# EAGLE design tweezer (EAGLE 9.4.2)
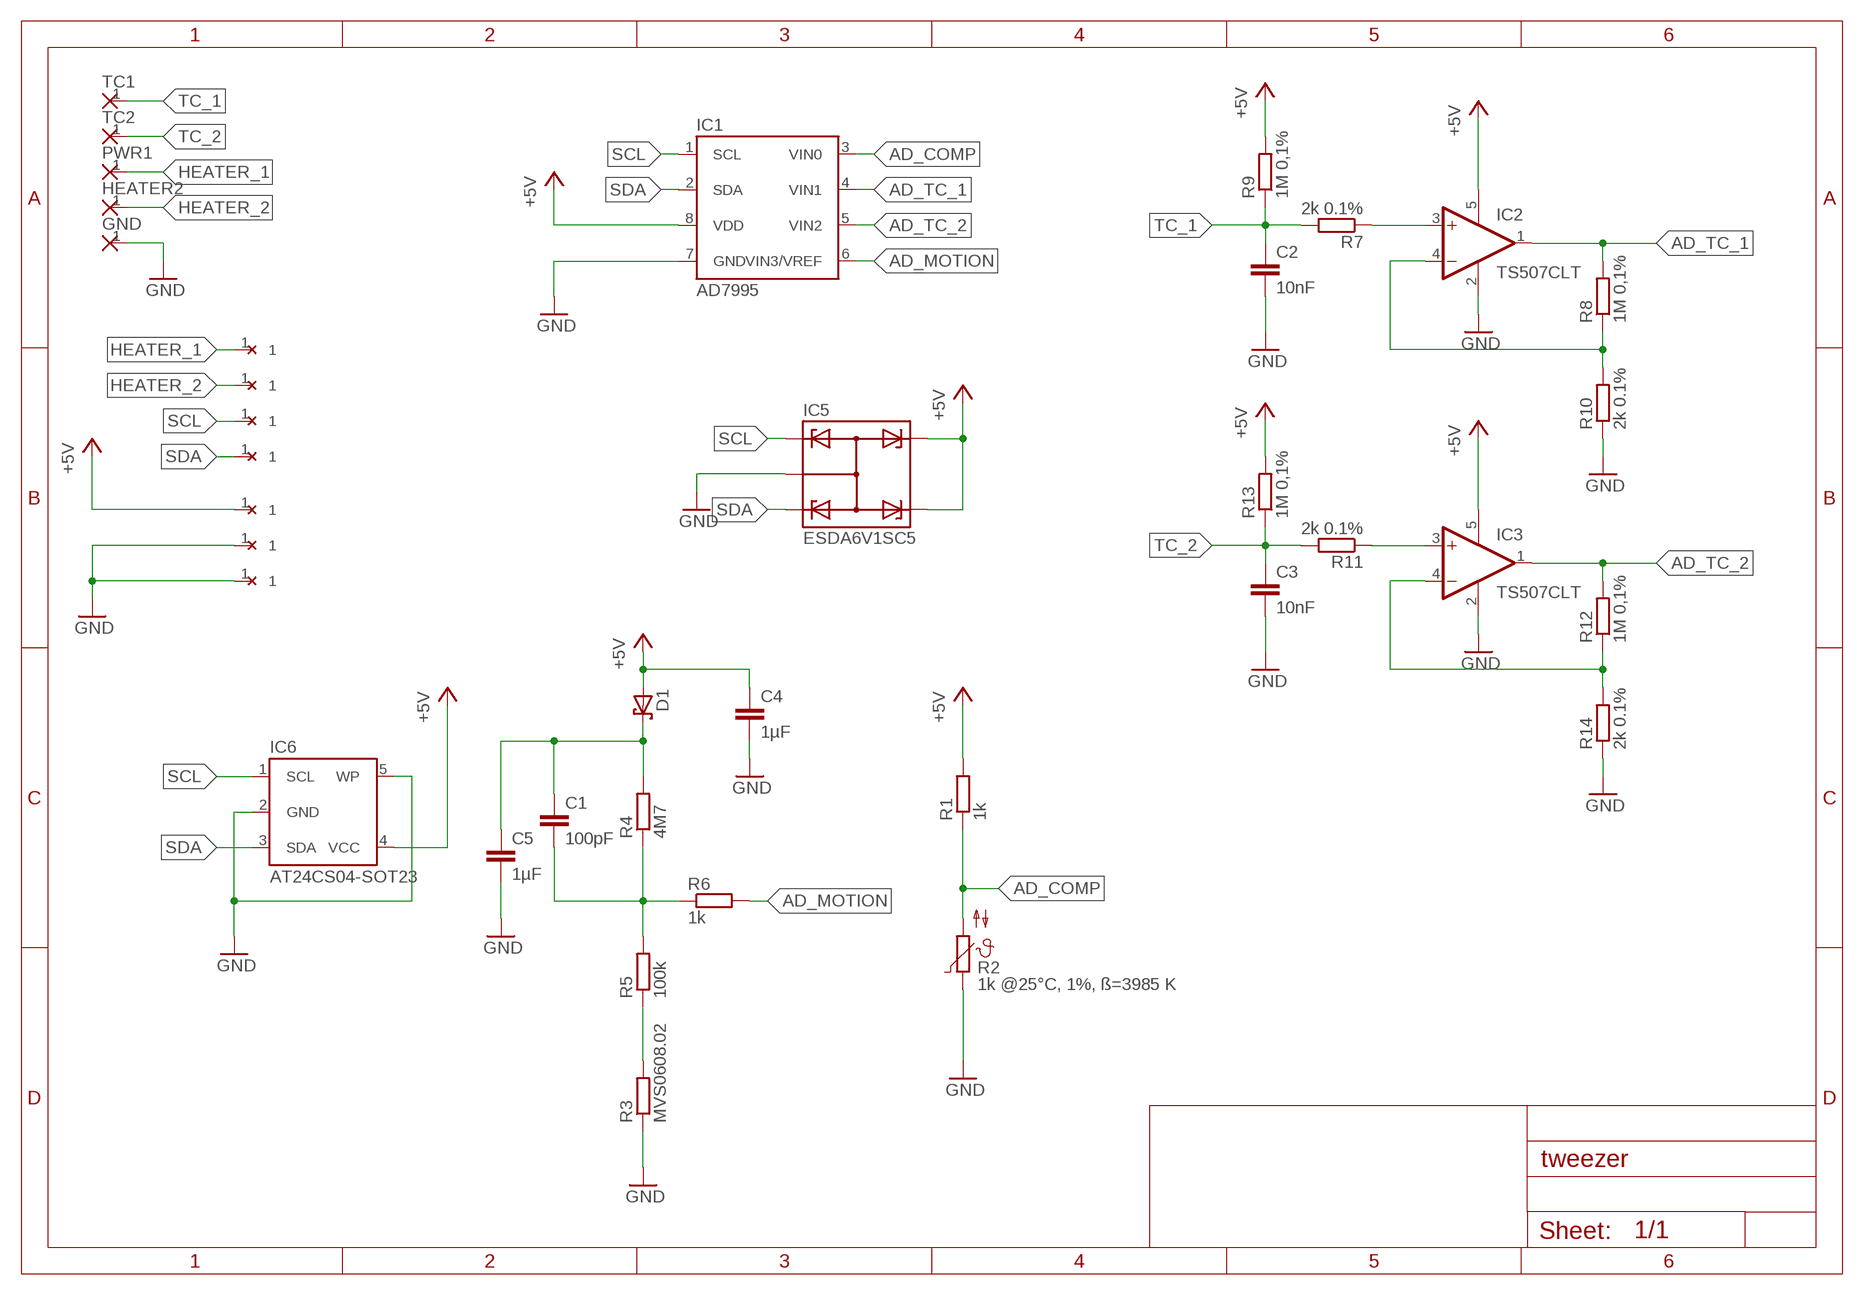
[diagram p0: schematic, sheet 1]

## Parts
21  WIREPAD  [WIREPAD]
C1  100pF  C-EU0603  [C0603]
C2  10nF  C-EU0603  [C0603]
C3  10nF  C-EU0603  [C0603]
C4  1µF  C-EU0603  [C0603]
C5  1µF  C-EU0603  [C0603]
D1  BAT54H  [SOD123-F]
GND  1,6/0,8  [1,6/0,8]
HEATER2  1,6/0,8  [1,6/0,8]
IC1  AD7995  [SOT23-8]
IC2  TS507CLT  [SOT23-5L]
IC3  TS507CLT  [SOT23-5L]
IC5  ESDA6V1SC5  [SOT23-5L]
IC6  AT24CS04-SOT23  [SOT23-5L]
PWR1  1,6/0,8  [1,6/0,8]
R1  1k  R-EU0603  [R0603]
R2  1k @25°C, 1%, ß=3985 K  NTC0603  [R0603]
R3  MVS0608.02  [VIBRA-SNS]
R4  4M7  R-EU0603  [R0603]
R5  100k  R-EU0603  [R0603]
R6  1k  R-EU0603  [R0603]
R7  2k 0.1%  R-EU0603  [R0603]
R8  1M 0,1%  R-EU0603  [R0603]
R9  1M 0,1%  R-EU0603  [R0603]
R10  2k 0.1%  R-EU0603  [R0603]
R11  2k 0.1%  R-EU0603  [R0603]
R12  1M 0,1%  R-EU0603  [R0603]
R13  1M 0,1%  R-EU0603  [R0603]
R14  2k 0.1%  R-EU0603  [R0603]
TC1  1,6/0,8  [1,6/0,8]
TC2  1,6/0,8  [1,6/0,8]
U$1  WIREPAD  [WIREPAD]
U$7  WIREPAD  [WIREPAD]
U$9  WIREPAD  [WIREPAD]
U$10  WIREPAD  [WIREPAD]
U$11  WIREPAD  [WIREPAD]
ß  WIREPAD  [WIREPAD]

## Nets
+5V: C4.1 D1.2(A) IC1.8(VDD) IC2.5(V+) IC3.5(V+) IC5.4 IC5.5 IC6.4(VCC) R1.2 R9.2 R13.2 U$10.1
AD_COMP: IC1.3(VIN0) R1.1 R2.2
AD_MOTION: IC1.6(VIN3/VREF) R6.2
AD_TC_1: IC1.4(VIN1) IC2.1(OUT) R8.2
AD_TC_2: IC1.5(VIN2) IC3.1(OUT) R12.2
FEEDBACK1: IC3.4(-IN) R12.1 R14.2
FEEDBACK_TC_1: IC2.4(-IN) R8.1 R10.2
GND: C2.2 C3.2 C4.2 C5.2 GND.1(P) IC1.7(GND) IC2.2(V-) IC3.2(V-) IC5.2 IC6.2(GND) IC6.5(WP) R2.1 R3.P$1 R10.1 R14.1 U$1.1 U$11.1
HEATER_1 [+12v]: PWR1.1(P) ß.1
HEATER_2 [+12v]: HEATER2.1(P) U$7.1
MOTION_DIV: R3.P$2 R5.1
MOTION_FIL: C1.2 R4.1 R5.2 R6.1
N$1: C1.1 C5.1 D1.1(C) R4.2
SCL: 21.1 IC1.1(SCL) IC5.1 IC6.1(SCL)
SDA: IC1.2(SDA) IC5.3 IC6.3(SDA) U$9.1
TC_1: C2.1 R7.2 R9.1 TC1.1(P)
TC_2: C3.1 R11.2 R13.1 TC2.1(P)
THERMO_FIL1: IC3.3(+IN) R11.1
THERMO_FIL_TC_1: IC2.3(+IN) R7.1

## Library data of the parts
21 U$1 U$7 U$9-U$11 ß = solderpi:WIREPAD
C1 = common:C-EU; OC_DIGIKEY: 478-7926-1-ND
C2 C3 = common:C-EU; OC_DIGIKEY: 478-6209-1-ND
C4 C5 = common:C-EU; OC_DIGIKEY: 1276-1034-1-ND
D1 = solderpi:BAT54H; OC_DIGIKEY: 1727-3569-1-ND
GND HEATER2 PWR1 TC1 TC2 = solderpi:1,6/0,8: THROUGH-HOLE PAD
IC1 = solderpi:AD7995; OC_DIGIKEY: AD7995YRJZ-1500RL7CT-ND
IC2 IC3 = solderpi:TS507CLT; OC_DIGIKEY: 497-6944-1-ND
IC5 = solderpi:ESDA6V1SC5; OC_DIGIKEY: 497-7748-1-ND
IC6 = solderpi:AT24CS04-SOT23; OC_DIGIKEY: AT24CS04-STUM-TCT-ND
R1 = common:R-EU; OC_DIGIKEY: P1.0KDBCT-ND
R2 = common:NTC; OC_DIGIKEY: P123687CT-ND
R3 = solderpi:MVS0608.02
R4 = common:R-EU; OC_DIGIKEY: 311-4.70MHRCT-ND
R5 = common:R-EU; OC_DIGIKEY: RMCF0603FT100KCT-ND
R6 = common:R-EU; OC_DIGIKEY: RMCF0603FT1K00CT-ND
R7 R10 R11 R14 = common:R-EU; OC_DIGIKEY: TNP2.00KAACT-ND
R8 R9 R12 R13 = common:R-EU; OC_DIGIKEY: YAG4498CT-ND

## Net classes
0 default: width 0.254 mm
1 +12v: width 0.254 mm, clearance 0.305 mm

## Board
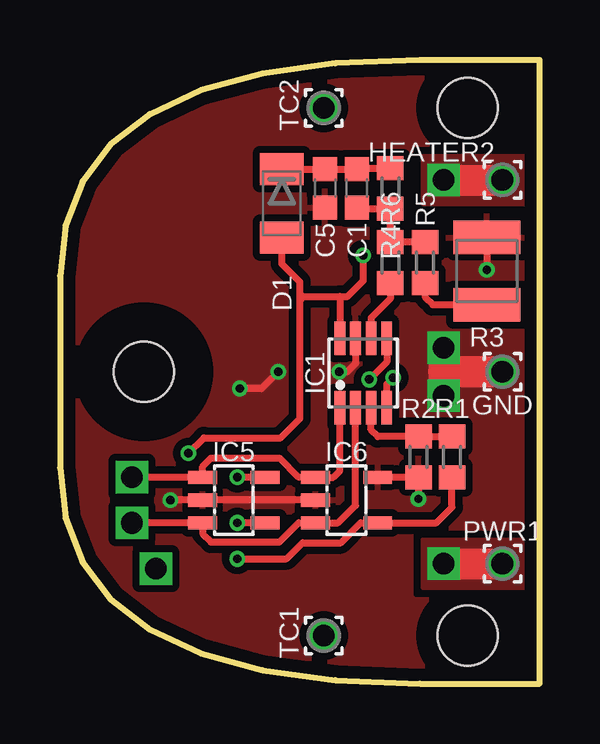
[diagram p1: board, top side]
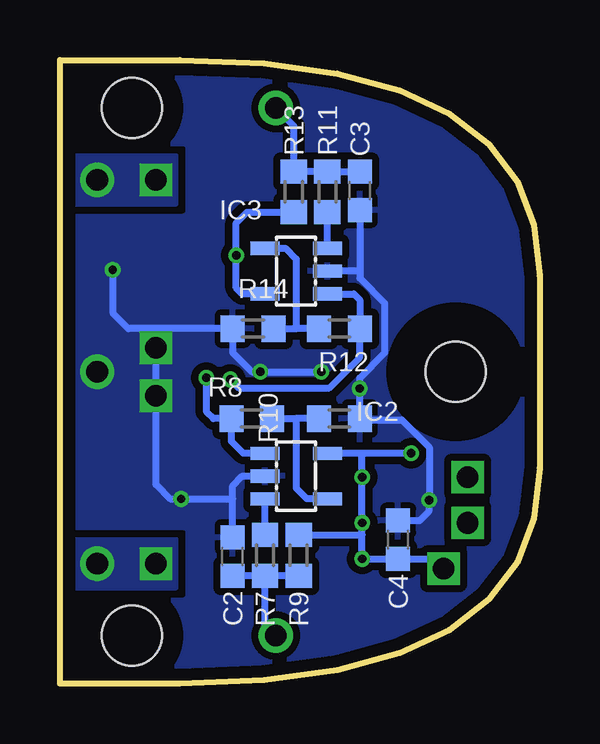
[diagram p2: board, bottom side, seen from below]

Size 20 x 26 mm. Coordinates in mm from the lower left corner, seen from the top.
Outline: 0,17 0,9 0.23,6.89 0.94,5.06 2.11,3.52 3.75,2.25 5.86,1.27 8.44,0.56 11.48,0.14 15,0 20,0 20,26 15,26 11.48,25.86 8.44,25.44 5.86,24.73 3.75,23.75 2.11,22.48 0.94,20.94 0.23,19.11 0,17
Copper layers (1*16): Top 0.035mm / dielectric 1.6mm / Bottom 0.035mm
Design rules "Elecrow_2-layer_PCB_eagle_rule *": minimum track width 6mil, minimum drill 12mil, track to track 6mil, track to pad 6mil, pad to pad 6mil, via to via 8mil, smd to smd 0mil, copper to edge 20mil, drill to drill 10mil, minimum pad ring 6mil, minimum via ring 6mil, stop-mask expansion 0mil, vias tented up to drill 100mil, thermal gap 10mil
Holes 2.5 mm at 3.5,13 17,2 17,24
tRestrict: area 1,10.5 to 6,15.5; area 1,10.5 to 6,15.5; area 15.2,22.2 to 18.8,25.8; area 15.2,0.2 to 18.8,3.8
bRestrict: area 15.2,22.2 to 18.8,25.8; area 15.2,0.2 to 18.8,3.8; area 1,10.5 to 6,15.5

### Footprints (pad centres in the part's own frame; a part is rotated, then mirrored left to right if it is on the bottom)
WIREPAD = drill 0.9 square: 1 0,0
C0603 = smd 1 x 1: 1 -0.8,0; 2 0.8,0
SOD123-F = smd 1.34 x 1.8: 1 -1.43,0; 2 1.43,0
1,6/0,8 = drill 0.9 pad 1.422: 1 0,0
SOT23-8 = smd 0.45 x 1.4: 1 -0.975,-1.45; 2 -0.325,-1.45; 3 0.325,-1.45; 4 0.975,-1.45; 5 0.975,1.45; 6 0.325,1.45; 7 -0.325,1.45; 8 -0.975,1.45
SOT23-5L = smd 0.55 x 1.2: 1 -0.95,-1.3; 2 0,-1.3; 3 0.95,-1.3; 4 0.95,1.3; 5 -0.95,1.3
R0603 = smd 1 x 1.1: 1 -0.85,0; 2 0.85,0
VIBRA-SNS = smd 1.4 x 2.8: P$1 -1.4,0; P$2 1.4,0

### Placement (x,y rotation side)
21  3,8.6 0 top
C1  12.38,20.65 270 top
C2  12.8,5.3 90 bottom
C3  7.5,20.55 270 bottom
C4  5.9,6 90 bottom
C5  11.05,20.65 270 top
D1  9.25,20.02 270 top
GND  18.45,13 0 top
HEATER2  18.45,21 0 top
IC1  12.65,12.95 0 top
IC2  10.15,8.65 270 bottom
IC3  10.15,17.2 90 bottom
IC5  7.25,7.65 270 top
IC6  11.95,7.65 270 top
PWR1  18.45,5 0 top
R1  16.35,9.45 270 top
R2  14.95,9.45 90 top
R3  17.8,17.2 270 top
R4  13.78,20.65 90 top
R5  15.22,17.55 90 top
R6  13.78,17.55 270 top
R7  11.45,5.35 270 bottom
R8  12,11.05 180 bottom
R9  10.05,5.35 90 bottom
R10  8.35,11.05 180 bottom
R11  8.85,20.5 90 bottom
R12  8.35,14.8 0 bottom
R13  10.25,20.5 270 bottom
R14  11.95,14.8 0 bottom
TC1  11,2 0 top
TC2  11,24 0 top
U$1  16,12 0 top
U$7  16,21 0 top
U$9  3,6.7 0 top
U$10  4,4.8 0 top
U$11  16,14 0 top
ß  16,5 0 top

### Tracks (layer width: path | path; a pad name or v marks a point on that pad's centre or on a via)
+5V  (via drill 0.35)
  Top 0.3: IC5.4 v7.4,6.7 | IC5.5 v7.4,8.6 | v7.4,5.2 9.45,5.2 10.12,5.87 11.71,5.87 12.54,6.7 IC6.4 15.7,6.7 16.35,7.35 R1.2 | v5.35,9.6 6,10.25 9.2,10.25 10,11.05 10,16 | 11.68,16.14 IC1.8 | 11.68,16.14 11.99,16.14 12.65,16.8 v12.65,17.85 | 10,16 10,16.75 9.25,17.5 D1.2 | 10,16 10.14,16.14 11.68,16.14
  Bottom 0.3: v7.4,6.7 v7.4,8.6 7.4,9.6 | v7.4,6.7 v7.4,5.2 C4.1 4.4,5.2 U$10.1 | R9.2 7.4,6.2 v7.4,6.7 | R13.2 12.2,19.65 12.65,19.2 v12.65,17.85 12.65,16.5 12.4,16.25 IC3.5 | v5.35,9.6 7.4,9.6 | 7.4,9.6 IC2.5
AD_COMP
  Top 0.3: R1.1 R2.2 13.25,10.3 12.97,10.57 IC1.3
AD_MOTION
  Top 0.3: R6.2 13.78,16.05 12.97,15.25 IC1.6
AD_TC_1  (via drill 0.35)
  Top 0.3: IC1.4 13.62,12.47 v13.9,12.75
  Bottom 0.3: IC2.1 12.35,9.6 12.85,10.1 R8.2 13.6,11.05 13.9,11.35 v13.9,12.75
AD_TC_2  (via drill 0.35)
  Top 0.3: IC1.5 13.62,13.4 v12.9,12.68
  Bottom 0.3: IC3.1 7.75,16.25 7.5,16 R12.2 7.5,13.6 8.77,12.33 12.55,12.33 v12.9,12.68
FEEDBACK1
  Bottom 0.3: R12.1 10.15,14.8 | 10.15,14.8 10.15,17.7 10.6,18.15 IC3.4 | R14.2 10.15,14.8
FEEDBACK_TC_1
  Bottom 0.3: IC2.4 9.7,7.7 10.15,8.15 10.15,11.05 | R10.2 10.15,11.05 | R8.1 10.15,11.05
GND  (via drill 0.35)
  Top 0.3: IC6.2 IC5.2 v4.6,7.65 | IC6.5 R2.1 v14.95,7.7 | IC1.7 12.32,13.35 11.98,13 v11.65,13 | v9.1,13 8.4,12.3 v7.5,12.3 | R3.P$1 v17.8,17.25
  Top 1.3: GND.1 16,13 | 16,13 U$1.1 | U$11.1 16,13
  Bottom 0.3: C2.2 12.8,7.7 | 12.8,7.7 12.8,8.25 12.4,8.65 IC2.2 | C3.2 7.5,17.2 | 7.5,17.2 7.5,16.9 6.45,15.85 6.45,13.8 7.5,12.75 v7.5,12.3 R10.1 7.45,11 5.75,11 4.6,9.85 v4.6,7.65 4.6,7.2 5,6.8 C4.2 | 7.5,17.2 IC3.2 | 12.8,7.7 v14.95,7.7 15.4,7.7 16,8.3 U$11.1 16,14.8 | v17.8,17.25 17.8,15.45 17.15,14.8 16,14.8 | 16,14.8 R14.1 12.8,13.8 12,13 v11.65,13 v9.1,13
  pour Top (isolate 0.305, rank 2): 0.23,6.89 0,9 0,17 0.23,19.11 0.94,20.94 2.11,22.48 3.75,23.75 5.86,24.73 8.44,25.44 11.48,25.86 15,26 20,26 20,0 15,0 11.48,0.14 8.44,0.56 5.86,1.27 3.75,2.25 2.11,3.52 0.94,5.06
  pour Bottom (isolate 0.305, rank 2): 0.23,6.89 0,9 0,17 0.23,19.11 0.94,20.94 2.11,22.48 3.75,23.75 5.86,24.73 8.44,25.44 11.48,25.86 15,26 20,26 20,0 15,0 11.48,0.14 8.44,0.56 5.86,1.27 3.75,2.25 2.11,3.52 0.94,5.06
  pour Bottom (no thermals): 15.05,11.1 15.05,14.9 17,14.9 17,14 19.35,14 19.35,12 17,12 17,11.1
  pour Top (isolate 0.305, no thermals): 15.05,11.1 15.05,14.9 17,14.9 17,14 19.35,14 19.35,12 17,12 17,11.1
HEATER_1
  Top 1.3: ß.1 PWR1.1
  pour Bottom (no thermals): 15.15,6 19.35,6 19.35,4 15.15,4
  pour Top (no thermals): 15.15,6 19.35,6 19.35,4 15.15,4
HEATER_2
  Top 1.3: U$7.1 HEATER2.1
  pour Bottom (no thermals): 15.15,22 19.35,22 19.35,20 15.15,20
  pour Top (no thermals): 15.15,22 19.35,22 19.35,20 15.15,20
MOTION_DIV
  Top 0.3: R5.1 15.22,16.12 15.55,15.8 R3.P$2
MOTION_FIL
  Top 0.3: R5.2 R6.1 R4.1 12.38,19.8 C1.2
N$1
  Top 0.3: D1.1 C5.1 C1.1 12.38,21.5 R4.2
SCL
  Top 0.3: 21.1 IC5.1 5.95,9.05 6.3,9.4 9.15,9.4 9.95,8.6 IC6.1 11.4,8.6 11.68,8.88 IC1.1
SDA
  Top 0.3: U$9.1 IC5.3 5.95,6.25 6.3,5.9 9.15,5.9 9.95,6.7 IC6.3 11.6,6.7 12.32,7.42 IC1.2
TC_1
  Bottom 0.3: R9.1 R7.2 | R7.2 C2.1 | TC1.1 11.45,2.45 R7.2
TC_2
  Bottom 0.3: C3.1 R11.2 R13.1 10.25,23.25 TC2.1
THERMO_FIL1
  Bottom 0.3: IC3.3 R11.1
THERMO_FIL_TC_1
  Bottom 0.3: R7.1 IC2.3